# EAGLE design attinier85-motherboard-pth-mk-1.0 (EAGLE 7.5.0)
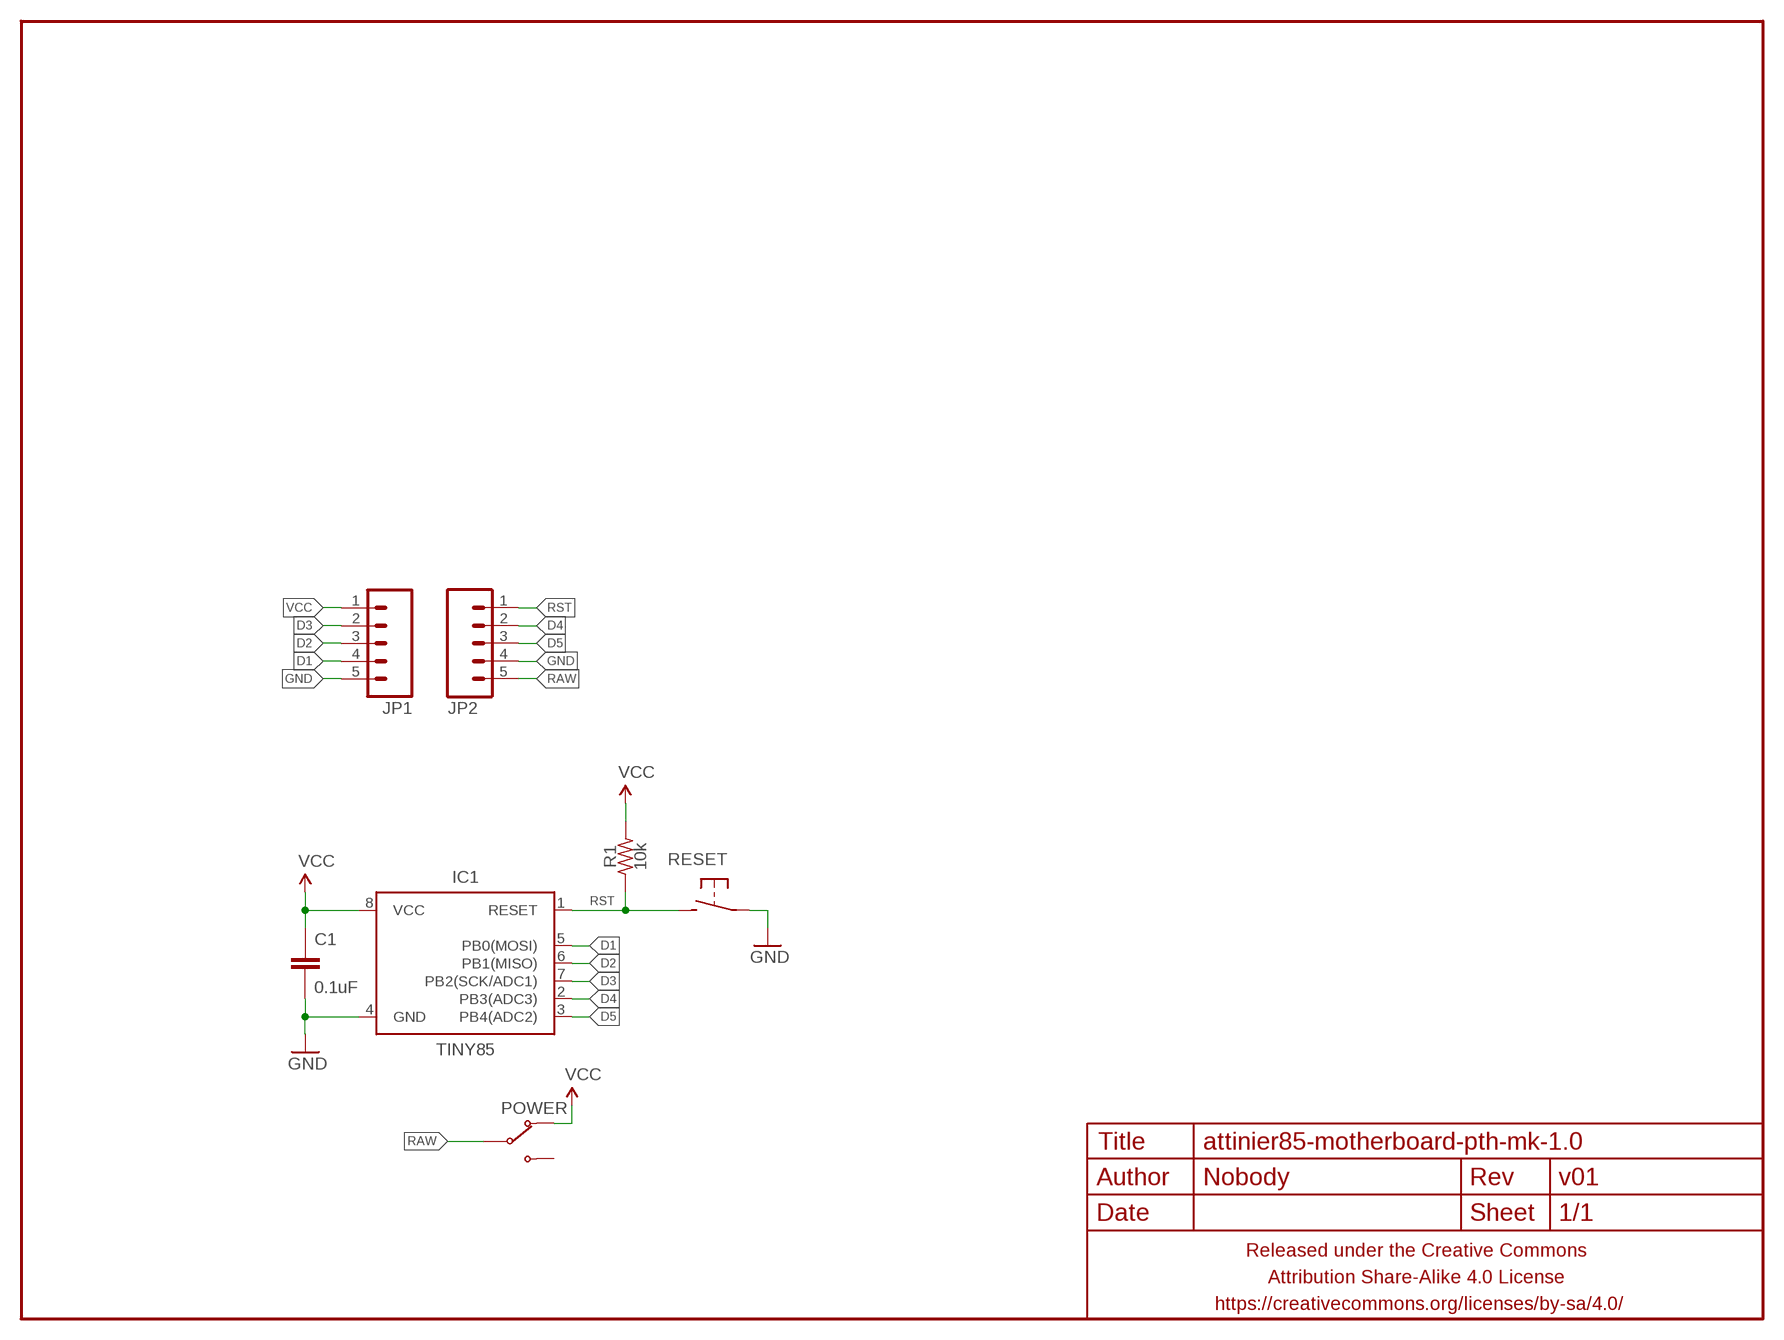
[diagram p0: schematic, sheet 1]

## Parts
C1  0.1uF  CAPACITOR-CERAMIC025-024X044  [C025-024X044]
FRAME1  FRAME-LETTERNO_PACKAGE  [DUMMY]
IC1  TINY85  ATTINY45TINY85-20-DIP  [DIP08]
JP1  M05PTH  [1X05]
JP2  M05PTH  [1X05]
POWER  SWITCH-SPDTPTH-RA-2.54MM  [SPDT-RA-2.54MM]
R1  10k  RESISTORPTH-AXIAL-7.62MM  [RESISTOR-AXIAL-PTH-7.62MM]
RESET  DTS-6MM  SPST-NO-TACT3MM-RA  [TACTILE-PTH-SIDE]

## Nets
D1: IC1.5(PB0(MOSI)) JP1.4
D2: IC1.6(PB1(MISO)) JP1.3
D3: IC1.7(PB2(SCK/ADC1)) JP1.2
D4: IC1.2(PB3(ADC3)) JP2.2
D5: IC1.3(PB4(ADC2)) JP2.3
GND: C1.2 IC1.4(GND) JP1.5 JP2.4 RESET.1
RAW: JP2.5 POWER.2(COM)
RST: IC1.1(RESET) JP2.1 R1.P$1 RESET.2
VCC: C1.1 IC1.8(VCC) JP1.1 POWER.1(NC) R1.P$2
Unconnected: POWER.3(NO)

## Library data of the parts
C1 = A_butts:CAPACITOR-CERAMIC: CAPACITOR, European symbol
FRAME1 = a_parts:FRAME-LETTER: Schematic Frame Standard 8.5x11 US Letter frame; DESIGNER: Nobody; VERSION: v01
IC1 = A_butts:ATTINY45: Atmel 8-pin 2/4/8kB flash uC; PROD_ID: IC-09445; VALUE: TINY85-20-DIP
JP1 JP2 = a_parts:M05: Header 5 Standard 5-pin 0.1" header. Use with straight break away headers (SKU : PRT-00116), right angle break away headers (PRT-00553), swiss pins (PRT-00743), machine pins (PRT-00117), and female headers (PRT-00115). Molex polarized connector foot print use with SKU : PRT-08230 with associated crimp pins and housings.
POWER = A_butts:SWITCH-SPDT
R1 = A_butts:RESISTOR: RESISTOR, American symbol
RESET = A_butts:SPST-NO-TACT

## Board
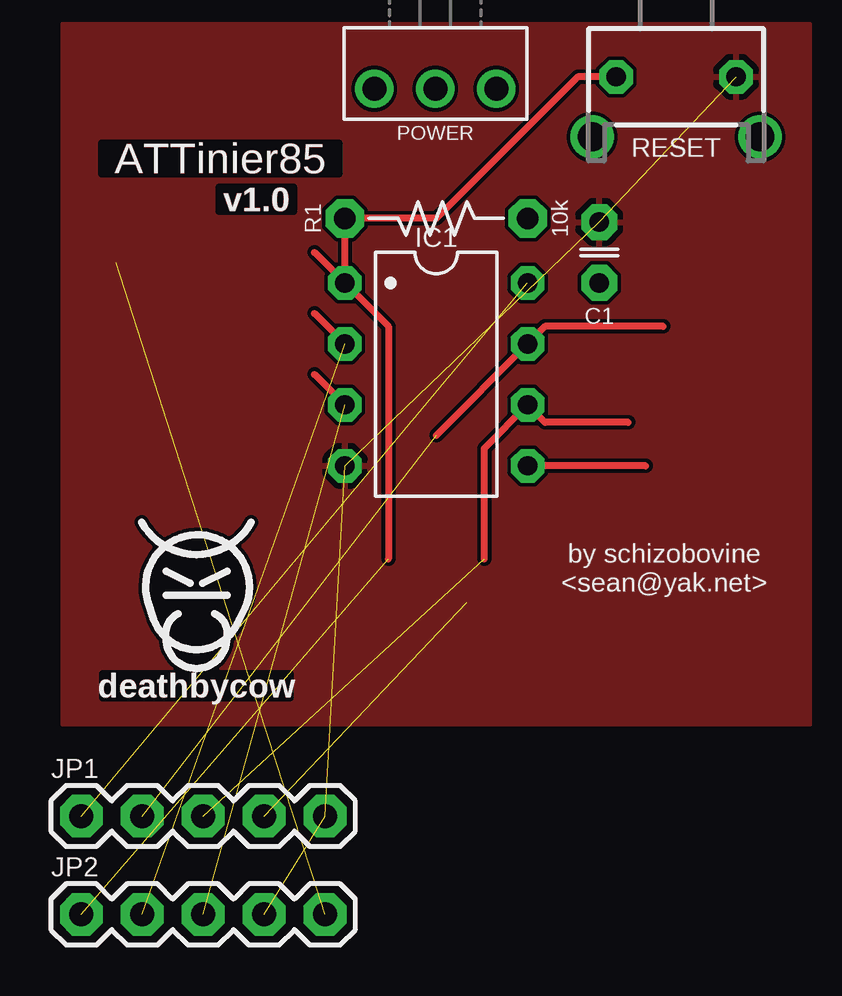
[diagram p1: board, top side]
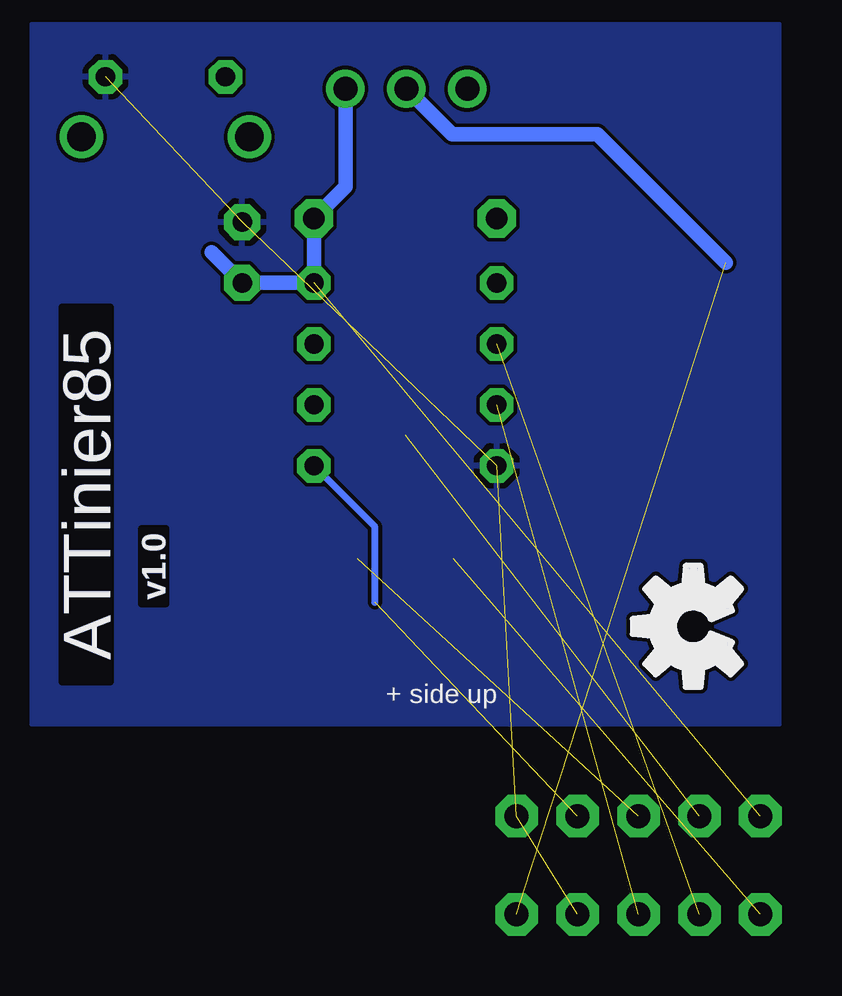
[diagram p2: board, bottom side, seen from below]

No outline drawn. Coordinates in mm, seen from the top.
Copper layers (1*16): Top 0.0356mm / dielectric 1.5011mm / Bottom 0.0356mm
Design rules "LaenPCBOrder2": minimum track width 6mil, minimum drill 13mil, track to track 6mil, track to pad 6mil, pad to pad 6mil, via to via 6mil, smd to smd 6mil, copper to edge 15mil, drill to drill 6mil, minimum pad ring 7mil, minimum via ring 7mil, stop-mask expansion 3mil, vias tented up to drill 20mil, thermal gap 10mil

### Footprints (pad centres in the part's own frame; a part is rotated, then mirrored left to right if it is on the bottom)
C025-024X044 = drill 0.813 pad 1.5 octagon: 1 -1.27,0; 2 1.27,0
DIP08 = drill 0.8 pad 1.4 octagon: 1 -3.81,-3.81; 2 -1.27,-3.81; 3 1.27,-3.81; 4 3.81,-3.81; 5 3.81,3.81; 6 1.27,3.81; 7 -1.27,3.81; 8 -3.81,3.81
1X05 = drill 1 pad 1.778 octagon: 1 0,0; 2 2.54,0; 3 5.08,0; 4 7.62,0; 5 10.16,0
SPDT-RA-2.54MM = drill 1 pad 1.6: 1 0,0; 2 2.54,0; 3 5.08,0
RESISTOR-AXIAL-PTH-7.62MM = drill 0.9 pad 1.6 octagon: P$1 -3.81,0; P$2 3.81,0
TACTILE-PTH-SIDE = drill 0.8 pad 1.4 octagon: 1 -2.5,0; 2 2.5,0 | drill 1.2 pad 1.778: ANCHOR1 -3.5,2.5; ANCHOR2 3.5,2.5

### Placement (x,y rotation side)
C1  22.3,19.58 90 top
FRAME1  -0.1,-0.2 0 top
IC1  15.5,14.5 270 top
JP1  0.7,-3.9 0 top
JP2  0.7,-8 0 top
POWER  18,26.4 180 top
R1  15.5,21 0 top
RESET  25.5,26.9 180 top
U$4  [OSHWLOGO_TOP_0.2]  3.5,4 90 bottom
U$5  [COW_SMALL_METAL]  5.5,5.8 0 top

### Tracks (layer width: path | path; a pad name or v marks a point on that pad's centre or on a via)
D1  (1 unrouted)
  Top 0.3: 24.23,10.69 IC1.5
  Bottom 0.3: 16.77,5 16.77,8.15 IC1.5
D2  (1 unrouted)
  Top 0.3: 23.5,12.5 20.04,12.5 IC1.6 17.5,11.42 17.5,6.81
D3  (1 unrouted)
  Top 0.3: 15.5,11.96 IC1.7 20.04,16.5 24.96,16.5
D4  (1 unrouted)
  Top 0.3: 10.42,17.04 IC1.2
D5  (1 unrouted)
  Top 0.3: 10.42,14.5 IC1.3
GND  (4 unrouted)
  pour Top: 31.1,29.1 31.1,-0.1 -0.1,-0.1 -0.1,29.1
  pour Bottom: 31.1,29.1 31.1,-0.1 -0.1,-0.1 -0.1,29.1
RAW  (1 unrouted)
  Bottom 0.6: 2.15,19.15 7.5,24.5 13.56,24.5 POWER.2
RST  (1 unrouted)
  Top 0.3: RESET.2 21.4,26.9 15.5,21 R1.P$1 IC1.1 | 10.42,19.58 IC1.1 | IC1.1 13.5,16.5 13.5,6.81
VCC  (1 unrouted)
  Bottom 0.6: POWER.1 18,22.31 R1.P$2 IC1.8 C1.1 23.57,19.58

### Text on the board
Top: ATTinier85
Bottom: ATTinier85
tPlace: ATTinier85 | by schizobovine / <sean@yak.net>
bPlace: ATTinier85 | + side up